# EAGLE design Un_51_2 (EAGLE 6.2)
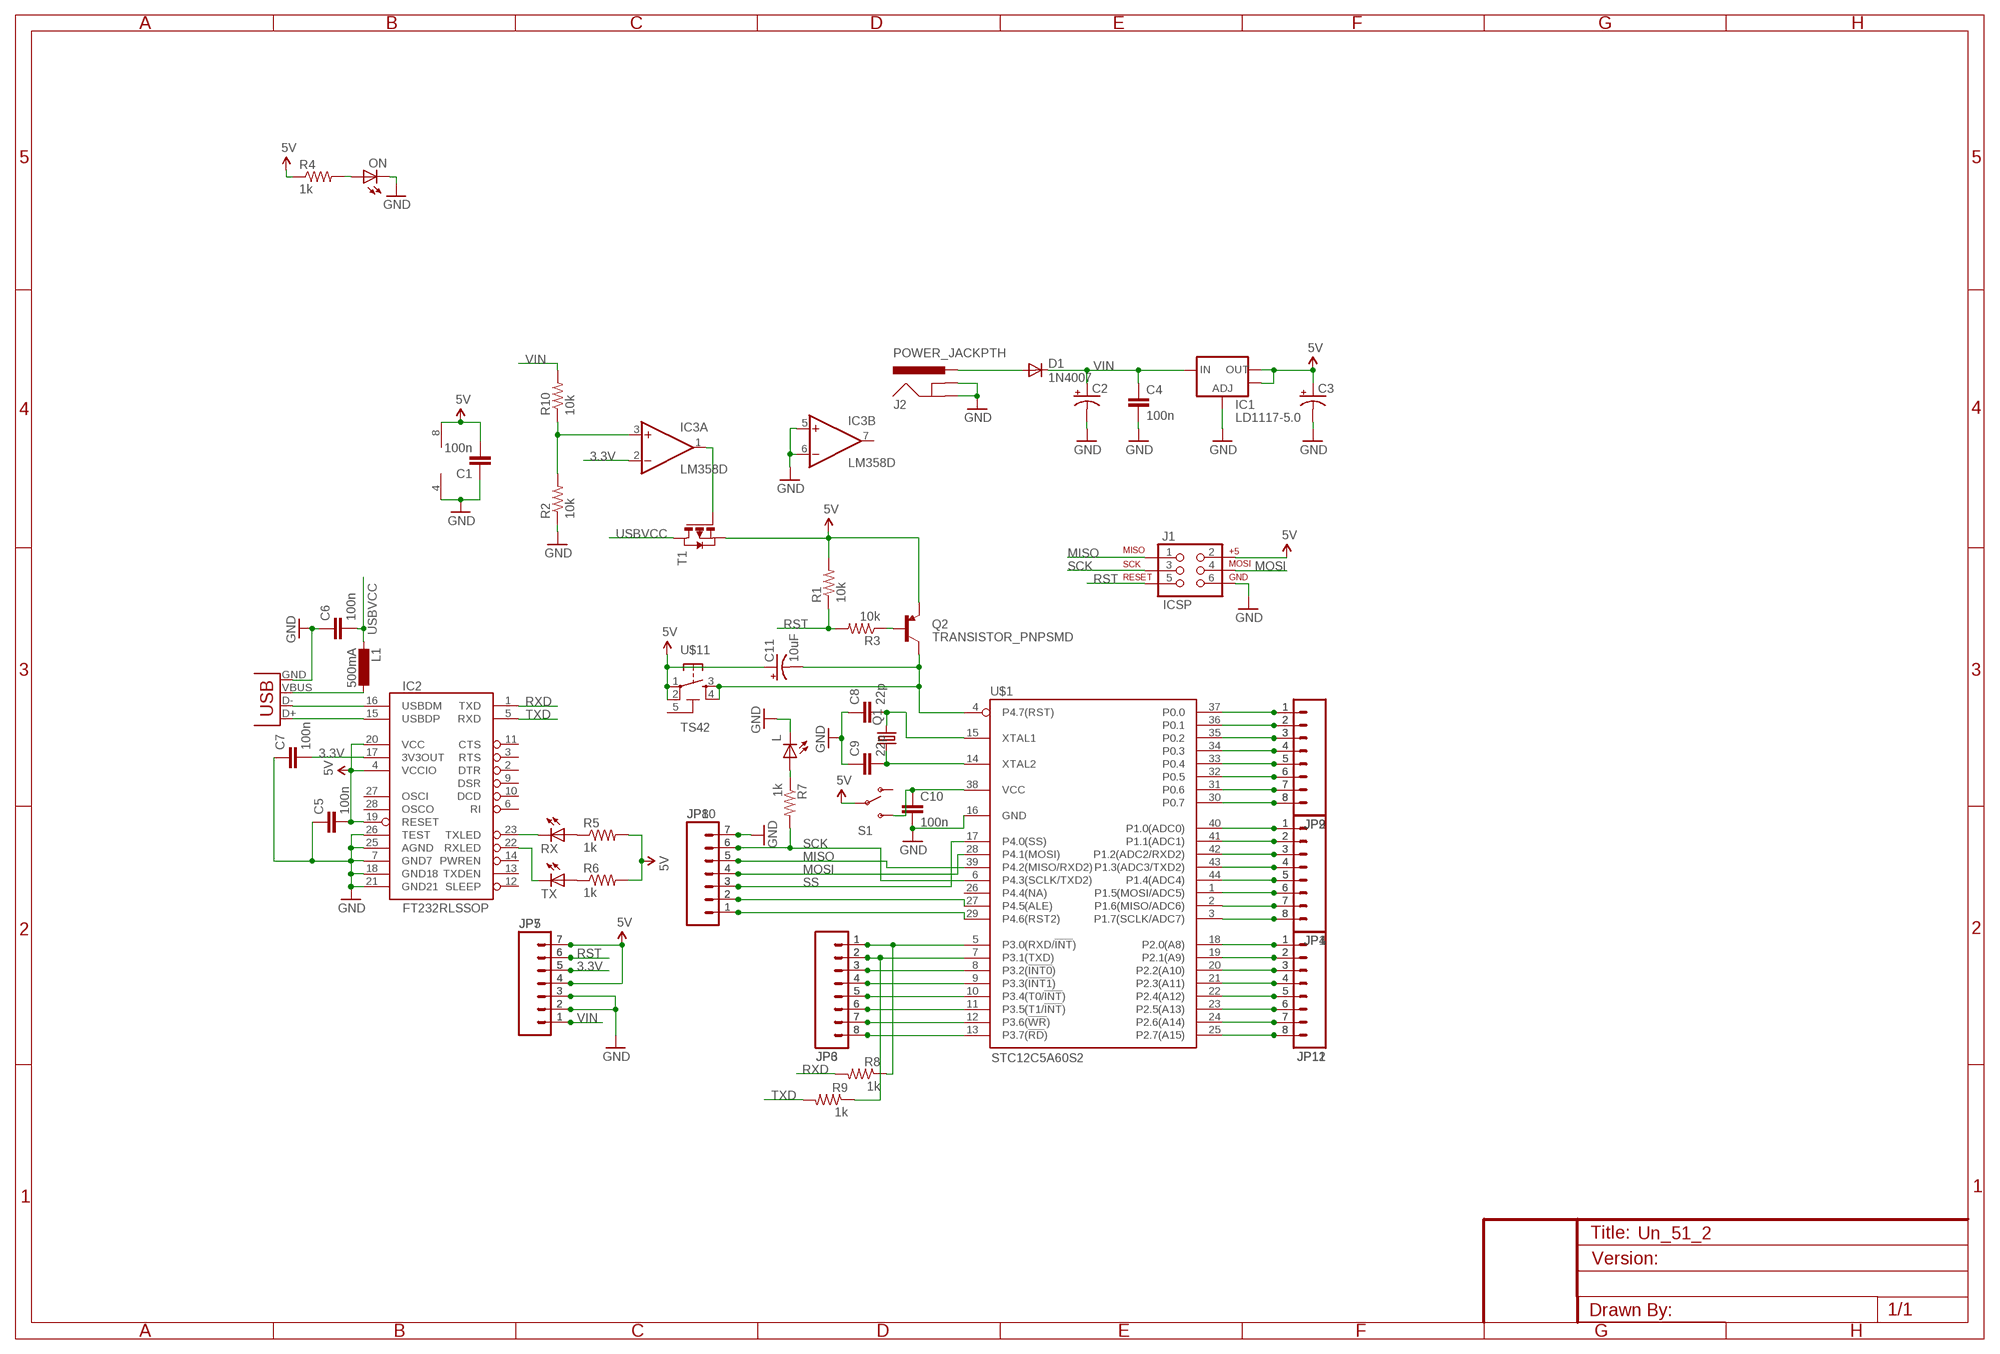
[diagram p0: schematic, sheet 1]

## Parts
C1  100n  CAP0603-CAP  [0603-CAP]
C2  CAP_POLD  [PANASONIC_D]
C3  CAP_POLD  [PANASONIC_D]
C4  100n  CAP0603-CAP  [0603-CAP]
C5  100n  CAP0603-CAP  [0603-CAP]
C6  100n  CAP0603-CAP  [0603-CAP]
C7  100n  CAP0603-CAP  [0603-CAP]
C8  22p  CAP0805  [0805]
C9  22p  CAP0805  [0805]
C10  100n  CAP0603-CAP  [0603-CAP]
C11  10uF  CAP_POL1206  [EIA3216]
D1  1N4007  DIODE-SMB  [SMB]
IC1  LD1117-5.0  V_REG_LM1117SOT223  [SOT223]
IC2  FT232RLSSOP  [SSOP28DB]
IC3  LM358D  [SO08]
J1  ICSP  AVR_SPI_PRG_6PTH  [2X3]
J2  POWER_JACKPTH  [POWER_JACK_PTH]
JP1  M081X08  [1X08]
JP2  M081X08  [1X08]
JP3  M08  [1X08]
JP4  M081X08  [1X08]
JP5  M07  [1X07]
JP6  M08  [1X08]
JP7  M07  [1X07]
JP8  M07  [1X07]
JP9  M081X08  [1X08]
JP10  M07  [1X07]
JP11  M081X08  [1X08]
JP12  M081X08  [1X08]
L  LED0805  [LED-0805]
L1  500mA  L-EUL1812  [L1812]
ON  LED0805  [LED-0805]
Q1  CRYSTALHC49US  [HC49US]
Q2  TRANSISTOR_PNPSMD  [SOT23-3]
R1  10k  RESISTOR0805-RES  [0805]
R2  10k  RESISTOR0805-RES  [0805]
R3  10k  RESISTOR0805-RES  [0805]
R4  1k  RESISTOR0805-RES  [0805]
R5  1k  RESISTOR0805-RES  [0805]
R6  1k  RESISTOR0805-RES  [0805]
R7  1k  RESISTOR0805-RES  [0805]
R8  1k  RESISTOR0805-RES  [0805]
R9  1k  RESISTOR0805-RES  [0805]
R10  10k  RESISTOR0805-RES  [0805]
RX  LED0805  [LED-0805]
S1  SWITCH-SPST  [SWITCH-SPDT2]
T1  PMOSSOT23  [SOT-23]
TX  LED0805  [LED-0805]
U$1  STC12C5A60S2  [TQFP44]
U$11  TS42  [TS42]
X1  USBPTH  [USB-B-PTH]

## Nets
3.3V: C7.2 IC2.17(3V3OUT) IC3.2(A:-IN) JP5.5 JP7.5
5V: C1.2 C3.+ C5.2 C11.A(+) IC1.2(OUT) IC1.4(OUT) IC2.4(VCCIO) IC2.19(RESET) IC2.20(VCC) IC3.8(P:V+) J1.2 JP5.4 JP5.7 JP7.4 JP7.7 Q2.2(E) R1.2 R4.1 R5.2 R6.2 S1.2(P) T1.2(S) U$11.1 U$11.2
A0: JP1.1 JP4.1 U$1.40(P1.0(ADC0))
GND [gnd]: C1.1 C2.- C3.- C4.2 C5.1 C6.1 C7.1 C8.1 C9.1 C10.2 IC1.1(ADJ) IC2.7(GND7) IC2.18(GND18) IC2.21(GND21) IC2.25(AGND) IC2.26(TEST) IC3.4(P:V-) IC3.5(B:+IN) IC3.6(B:-IN) J1.6 J2.GND J2.GNDBREAK JP5.2 JP5.3 JP7.2 JP7.3 JP8.7 JP10.7 L.2(C) ON.2(C) R2.1 U$1.16(GND) X1.GND
MISO: J1.1 JP8.5 JP10.5 U$1.39(P4.2(MISO/RXD2))
MOSI: J1.4 JP8.4 JP10.4 U$1.28(P4.1(MOSI))
N$1: IC3.3(A:+IN) R2.2 R10.1
N$2: IC3.1(A:OUT) T1.3(G)
N$3: L1.1 X1.VBUS
N$4: D1.A J2.PWR
N$5: IC2.16(USBDM) X1.D-
N$6: IC2.15(USBDP) X1.D+
N$7: R5.1 RX.1(A)
N$8: R6.1 TX.1(A)
N$9: IC2.23(TXLED) RX.2(C)
N$10: IC2.22(RXLED) TX.2(C)
N$11: JP3.1 JP6.1 R8.1 U$1.5(P3.0(RXD/!INT!))
N$12: JP1.7 JP4.7 U$1.2(P1.6(MISO/ADC6))
N$13: JP1.8 JP4.8 U$1.3(P1.7(SCLK/ADC7))
N$14: L.1(A) R7.1
N$15: C10.1 S1.3(S) U$1.38(VCC)
N$16: JP8.1 JP10.1 U$1.29(P4.6(RST2))
N$17: JP8.2 JP10.2 U$1.27(P4.5(ALE))
N$18: C11.C(-) Q2.3(C) U$1.4(P4.7(RST)) U$11.3 U$11.4
N$19: Q2.1(B) R3.1
N$20: JP2.1 JP9.1 U$1.37(P0.0)
N$22: JP2.2 JP9.2 U$1.36(P0.1)
N$23: JP3.2 JP6.2 R9.1 U$1.7(P3.1(TXD))
N$24: JP3.3 JP6.3 U$1.8(P3.2(!INT0!))
N$25: JP3.4 JP6.4 U$1.9(P3.3(!INT1!))
N$26: JP3.5 JP6.5 U$1.10(P3.4(T0/!INT!))
N$27: JP3.6 JP6.6 U$1.11(P3.5(T1/!INT!))
N$28: JP3.7 JP6.7 U$1.12(P3.6(!WR!))
N$30: JP3.8 JP6.8 U$1.13(P3.7(!RD!))
N$31: JP1.2 JP4.2 U$1.41(P1.1(ADC1))
N$32: JP1.3 JP4.3 U$1.42(P1.2(ADC2/RXD2))
N$33: JP1.4 JP4.4 U$1.43(P1.3(ADC3/TXD2))
N$34: ON.1(A) R4.2
N$35: JP2.3 JP9.3 U$1.35(P0.2)
N$36: JP2.4 JP9.4 U$1.34(P0.3)
N$37: JP2.5 JP9.5 U$1.33(P0.4)
N$39: C8.2 Q1.2 U$1.15(XTAL1)
N$40: C9.2 Q1.1 U$1.14(XTAL2)
N$41: JP2.6 JP9.6 U$1.32(P0.5)
N$42: JP2.7 JP9.7 U$1.31(P0.6)
N$43: JP2.8 JP9.8 U$1.30(P0.7)
N$44: JP11.1 JP12.1 U$1.18(P2.0(A8))
N$45: JP11.2 JP12.2 U$1.19(P2.1(A9))
N$46: JP11.3 JP12.3 U$1.20(P2.2(A10))
N$47: JP11.4 JP12.4 U$1.21(P2.3(A11))
N$48: JP11.5 JP12.5 U$1.22(P2.4(A12))
N$49: JP11.6 JP12.6 U$1.23(P2.5(A13))
N$50: JP11.7 JP12.7 U$1.24(P2.6(A14))
N$51: JP11.8 JP12.8 U$1.25(P2.7(A15))
RST: J1.5 JP5.6 JP7.6 R1.1 R3.2
RXD: IC2.1(TXD) R8.2
SCK: J1.3 JP8.6 JP10.6 R7.2 U$1.6(P4.3(SCLK/TXD2))
SCL: JP1.6 JP4.6 U$1.1(P1.5(MOSI/ADC5))
SDA: JP1.5 JP4.5 U$1.44(P1.4(ADC4))
SS: JP8.3 JP10.3 U$1.17(P4.0(SS))
TXD: IC2.5(RXD) R9.2
USBVCC: C6.2 L1.2 T1.1(D)
VIN: C2.+ C4.1 D1.C IC1.3(IN) JP5.1 JP7.1 R10.2
Unconnected: IC2.2(DTR) IC2.3(RTS) IC2.6(RI) IC2.9(DSR) IC2.10(DCD) IC2.11(CTS) IC2.12(SLEEP) IC2.13(TXDEN) IC2.14(PWREN) IC2.27(OSCI) IC2.28(OSCO) IC3.7(B:OUT) S1.1(O) U$1.26(P4.4(NA)) U$11.5

## Library data of the parts
C1 C4-C10 = 1SparkFun:CAP: Capacitor Standard 0603 ceramic capacitor, and 0.1" leaded capacitor.
C2 C3 C11 = 2SparkFun:CAP_POL: Capacitor Polarized These are standard SMD and PTH capacitors. Normally 10uF, 47uF, and 100uF in electrolytic and tantalum varieties. Always verify the external diameter of the through hole cap, it varies with capacity, voltage, and manufacturer. The EIA devices should be standard.
D1 = diode:DIODE-: DIODE
IC1 = 1SparkFun:V_REG_LM1117: Voltage Regulator LM1117 Standard adjustable voltage regulator but in SMD form. Spark Fun Electronics SKU : COM-00595
IC2 = 1SparkFun:FT232RL: USB UART FT232RL 4th Generation USB UART (USB <-> Serial) Controller. Spark Fun Electronics SKU : COM-00650
IC3 = linear:LM358: OP AMP also LM158; LM258; LM2904 Source: http://cache.national.com/ds/LM/LM158.pdf
J1 = 1SparkFun:AVR_SPI_PRG_6: AVR ISP 6 Pin This is the reduced ISP connector for AVR programming. Common on Arduino. This footprint will take up less PCB space and can be used with a 10-pin to 6-pin adapter such as SKU: BOB-08508
J2 = 2SparkFun:POWER_JACK: Power Jack This is the standard 5.5mm barrel jack for power. The PTH is the most common, proven, reliable, footprint. All others are experimental. The Slot footprint only works if the mill layer is transmitted to the PCB fab house so be warned. Spark Fun Electronics SKU : PRT-00119. Mating wall wart : TOL-00298 (and others)
JP1 JP2 JP4 JP9 JP11 JP12 = 2SparkFun:M08: Header 8 Standard 8-pin 0.1" header. Use with straight break away headers (SKU : PRT-00116), right angle break away headers (PRT-00553), swiss pins (PRT-00743), machine pins (PRT-00117), and female headers (PRT-00115).
JP3 JP6 = 1SparkFun:M08: Header 8 Standard 8-pin 0.1" header. Use with straight break away headers (SKU : PRT-00116), right angle break away headers (PRT-00553), swiss pins (PRT-00743), machine pins (PRT-00117), and female headers (PRT-00115).
JP5 JP7 JP8 JP10 = 2SparkFun:M07: Header 7 Standard 7-pin 0.1" header. Use with straight break away headers (SKU : PRT-00116), right angle break away headers (PRT-00553), swiss pins (PRT-00743), machine pins (PRT-00117), and female headers (PRT-00115). NOTES ON THE VARIANTS LOCK and LOCK_LONGPADS... This footprint was designed to help hold the alignment of a through-hole component (i.e. 7-pin header) while soldering it into place. You may notice that each hole has been shifted either up or down by 0.005 of an inch from it's more standard position (which is usually a perfectly straight line). This slight alteration caused the pins (the squares in the middle) to touch the edges of the holes. Because they are alternating, it causes a "brace" to hold the header in place. 0.005 has proven to be the perfect amount of "off-center" position when using our standard breakaway headers. Although looks a little odd when you look at the bare footprint, once you have a header in there, the alteration is very hard to notice. Also, if you push a header all the way into place, it is covered up entirely on the bottom side. This idea of altering the position of holes to aid alignment will be further integrated into the Sparkfun Library for other footprints. It can help hold any component with 3 or more connection pins.
L ON RX TX = 1SparkFun:LED: LEDs Standard schematic elements and footprints for 5mm, 3mm, 1206, and 0603 sized LEDs. 5mm - Spark Fun Electronics SKU : COM-00529 (and others)
L1 = rcl:L-EU: INDUCTOR, European symbol
Q1 = 1SparkFun:CRYSTAL: Crystals Various standard crystals. Proven footprints. Spark Fun Electronics SKU : COM-00534
Q2 = 1SparkFun:TRANSISTOR_PNP
R1-R10 = 2SparkFun:RESISTOR: Resistor Basic schematic elements and footprints for 0603, 1206, and PTH resistors.
S1 = 2SparkFun:SWITCH-SPST: SPST Switch Simple slide switch. Spark Fun Electronics SKU : COM-00102
T1 = zetex:PMOSSOT23: MOS FET; OC_FARNELL: unknown; OC_NEWARK: unknown
U$1 = 2SparkFun:STC12C5A60S2
U$11 = 2SparkFun:TS42
X1 = 1SparkFun:USB: USB Connectors USB-B-PTH is fully proven SKU : PRT-00139 USB-miniB is fully proven SKU : PRT-00587 USB-A-PCB is untested. USB-A-H is throughly reviewed, but untested. Spark Fun Electronics SKU : PRT-00437 USB-B-SMT is throughly reviewed, but untested. Needs silkscreen touching up. USB-A-S has not been used/tested USB-MB-H has not been used/tested

## Net classes
0 default: width 0.254 mm, clearance 0.254 mm
1 power: width 0.61 mm, drill 0.61 mm, clearance 0.254 mm
2 gnd: width 0.305 mm, drill 0.559 mm, clearance 0.254 mm
3 usbvcc: width 0.508 mm, drill 0.61 mm, clearance 0.254 mm
4 aref: width 0.406 mm, drill 0.61 mm, clearance 0.254 mm

## Board
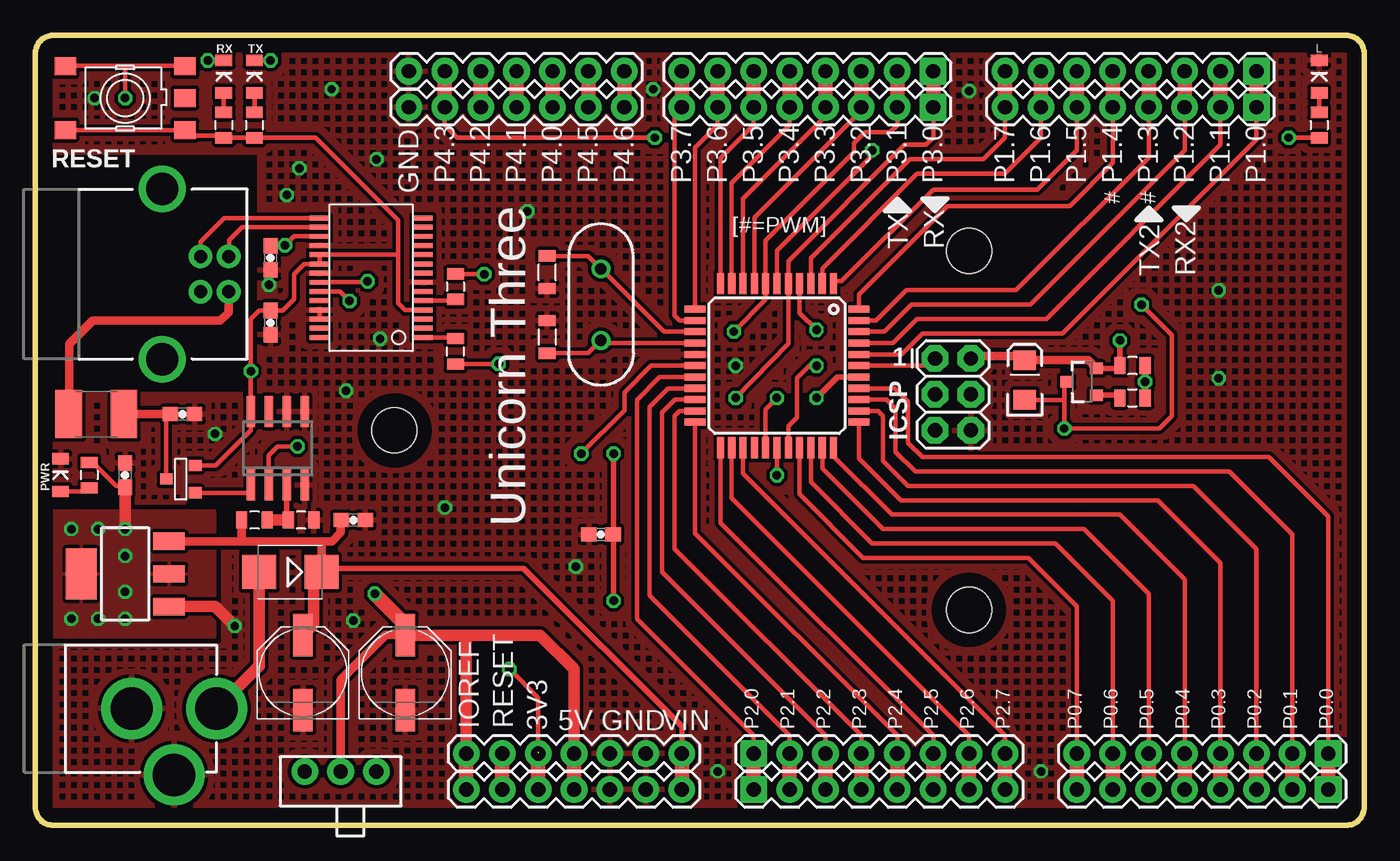
[diagram p1: board, top side]
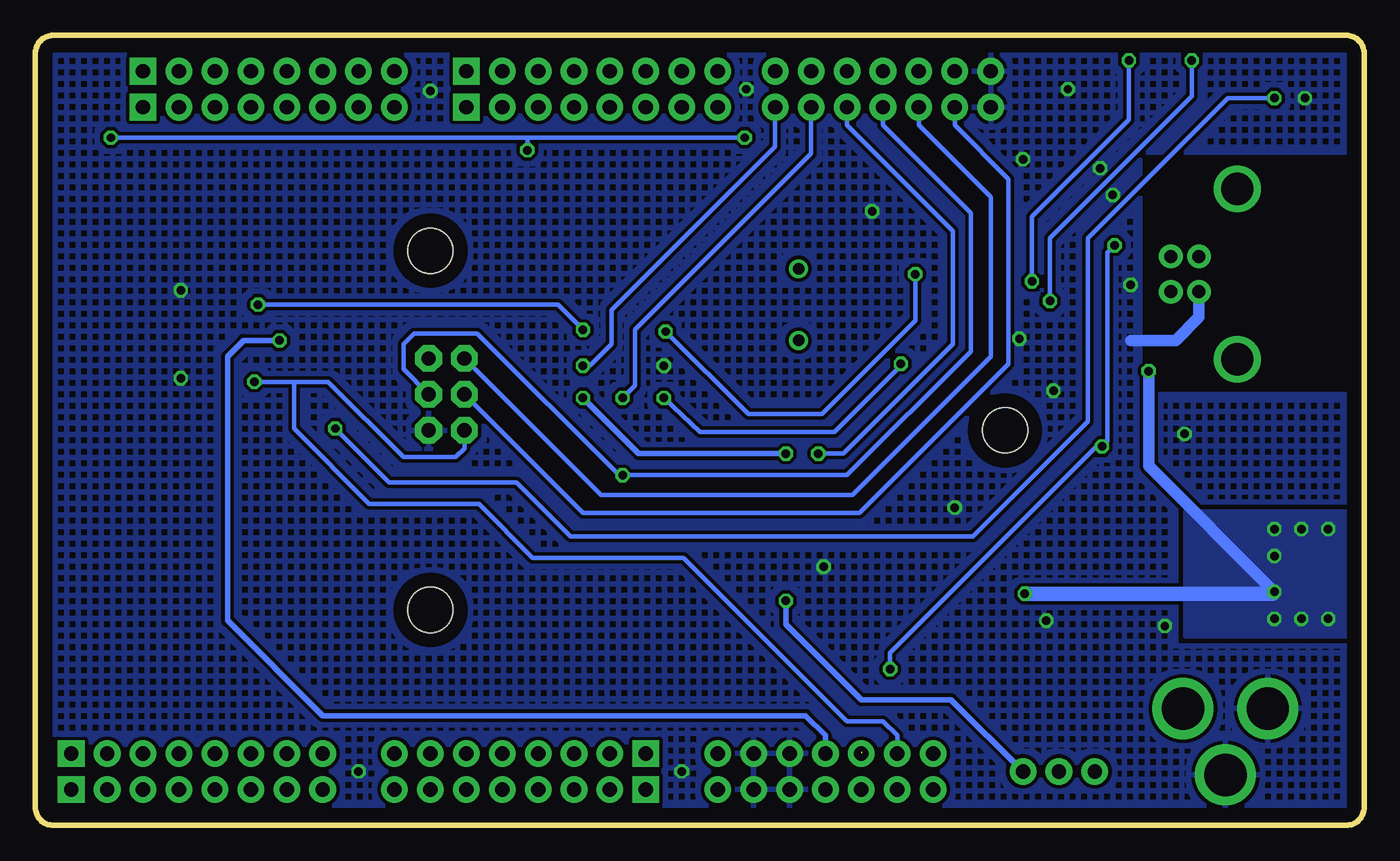
[diagram p2: board, bottom side, seen from below]

Size 93.98 x 55.88 mm. Coordinates in mm from the lower left corner, seen from the top.
Outline: 1.27,0 92.71,0 arc90 93.98,1.27 93.98,54.61 arc90 92.71,55.88 1.27,55.88 arc90 0,54.61 0,1.27 arc90 1.27,0
Copper layers (1*16): Top 0.035mm / dielectric 1.5mm / Bottom 0.035mm
Design rules "default": minimum track width 10mil, minimum drill 24mil, track to track 8mil, track to pad 8mil, pad to pad 8mil, via to via 8mil, smd to smd 8mil, copper to edge 40mil, drill to drill 8mil, minimum pad ring 10mil, minimum via ring 8mil, stop-mask expansion 4mil, vias tented up to drill 0mil, thermal gap 10mil
Holes 3.2 mm at 66.04,40.64 66.04,15.24 25.4,27.94

### Footprints (pad centres in the part's own frame; a part is rotated, then mirrored left to right if it is on the bottom)
0603-CAP = smd 1.1 x 1: 1 -0.85,0; 2 0.85,0
PANASONIC_D = smd 3 x 1.4: + 2.654,0; - -2.654,0
0805 = smd 0.8 x 1.2: 1 -1.154,0; 2 1.154,0
EIA3216 = smd 1.4 x 1.6: A 1.4,0; C -1.4,0
SMB = smd 2.4 x 2.4: A 2.2,0; C -2.2,0
SOT223 = smd 1.219 x 2.235: 1 -2.311,-3.099; 2 0,-3.099; 3 2.311,-3.099 | smd 3.6 x 2.2: 4 0,3.099
SSOP28DB = smd 0.348 x 1.397: 1 -4.225,-3.656; 2 -3.575,-3.656; 3 -2.925,-3.656; 4 -2.275,-3.656; 5 -1.625,-3.656; 6 -0.975,-3.656; 7 -0.325,-3.656; 8 0.325,-3.656; 9 0.975,-3.656; 10 1.625,-3.656; 11 2.275,-3.656; 12 2.925,-3.656; 13 3.575,-3.656; 14 4.225,-3.656; 15 4.225,3.656; 16 3.575,3.656; 17 2.925,3.656; 18 2.275,3.656; 19 1.625,3.656; 20 0.975,3.656; 21 0.325,3.656; 22 -0.325,3.656; 23 -0.975,3.656; 24 -1.625,3.656; 25 -2.275,3.656; 26 -2.925,3.656; 27 -3.575,3.656; 28 -4.225,3.656
SO08 = smd 0.6 x 2.2: 1 -1.905,-2.6; 2 -0.635,-2.6; 3 0.635,-2.6; 4 1.905,-2.6; 5 1.905,2.6; 6 0.635,2.6; 7 -0.635,2.6; 8 -1.905,2.6
2X3 = drill 1.016 pad 1.88 octagon: 1 0,0; 2 0,2.54; 3 2.54,0; 4 2.54,2.54; 5 5.08,0; 6 5.08,2.54
POWER_JACK_PTH = drill 2.997 pad 4.318: GND 0,7.7; GNDBREAK 4.7,10.7; PWR 0,13.7
1X08 = drill 1.016 pad 1.88 square: 1 0,0 | drill 1.016 pad 1.88: 2 2.54,0; 3 5.08,0; 4 7.62,0; 5 10.16,0; 6 12.7,0; 7 15.24,0; 8 17.78,0
1X07 = drill 1.016 pad 1.88: 1 0,0; 2 2.54,0; 3 5.08,0; 4 7.62,0; 5 10.16,0; 6 12.7,0; 7 15.24,0
LED-0805 = smd 0.8 x 1.2: 1 -1.154,0; 2 1.154,0
L1812 = smd 1.9 x 3.4: 1 -1.95,0; 2 1.95,0
HC49US = drill 0.813: 1 -2.54,0; 2 2.54,0
SOT23-3 = smd 0.8 x 0.9: 1 -0.95,-1; 2 0.95,-1; 3 0,1.1
0805' = smd 0.8 x 1.2: 1 -0.9,0; 2 0.9,0
SWITCH-SPDT2 = drill 1.016 pad 1.88: 1 0,2.54; 2 0,0; 3 0,-2.54
SOT-23 = smd 0.787 x 0.889: 1 0.025,-1.016; 2 -0.94,1.016; 3 0.991,1.016
TQFP44 = smd 1.5 x 0.5: 1 -5.8,4; 2 -5.8,3.2; 3 -5.8,2.4; 4 -5.8,1.6; 5 -5.8,0.8; 6 -5.8,0; 7 -5.8,-0.8; 8 -5.8,-1.6; 9 -5.8,-2.4; 10 -5.8,-3.2; 11 -5.8,-4; 23 5.8,-4; 24 5.8,-3.2; 25 5.8,-2.4; 26 5.8,-1.6; 27 5.8,-0.8; 28 5.8,0; 29 5.8,0.8; 30 5.8,1.6; 31 5.8,2.4; 32 5.8,3.2; 33 5.8,4 | smd 0.5 x 1.5: 12 -4,-5.8; 13 -3.2,-5.8; 14 -2.4,-5.8; 15 -1.6,-5.8; 16 -0.8,-5.8; 17 0,-5.8; 18 0.8,-5.8; 19 1.6,-5.8; 20 2.4,-5.8; 21 3.2,-5.8; 22 4,-5.8; 34 4,5.8; 35 3.2,5.8; 36 2.4,5.8; 37 1.6,5.8; 38 0.8,5.8; 39 0,5.8; 40 -0.8,5.8; 41 -1.6,5.8; 42 -2.4,5.8; 43 -3.2,5.8; 44 -4,5.8
TS42 = smd 1.524 x 1.27: 1 -4.229,2.25; 2 4.229,2.25; 3 -4.229,-2.25; 4 4.229,-2.25; 5 -4.229,-0.002
USB-B-PTH = drill 0.914 pad 1.676: D+ 0,1.25; D- 1.981,1.25; GND 0,-1.25; VBUS 1.981,-1.25 | drill 2.286: P$1 -2.718,-6.02; P$2 -2.718,6.02

### Placement (x,y rotation side)
C1  6.35,24.77 270 top
C2  18.92,10.79 90 top
C3  26.16,10.79 90 top
C4  22.48,21.59 0 top
C5  16.64,35.56 90 top
C6  10.41,29.08 180 top
C7  16.64,40.13 90 top
C8  36.19,34.54 270 top
C9  36.19,39.12 90 top
C10  40,20.57 180 top
C11  69.98,31.5 90 top
D1  18.03,17.91 180 top
IC1  6.35,17.78 90 top
IC2  23.75,38.73 90 top
IC3  17.14,26.67 0 top
J1  63.63,33.02 270 top
J2  -0.89,8.26 270 top
JP1  86.36,53.34 180 top
JP2  91.44,5.08 180 top
JP3  63.5,53.34 180 top
JP4  86.36,50.8 180 top
JP5  45.72,2.54 180 top
JP6  63.5,50.8 180 top
JP7  45.72,5.08 180 top
JP8  41.66,50.8 180 top
JP9  91.44,2.54 180 top
JP10  41.66,53.34 180 top
JP11  50.8,5.08 0 top
JP12  50.8,2.54 0 top
L  90.81,52.96 90 top
L1  4.32,29.08 0 top
ON  1.78,24.77 90 top
Q1  40,36.83 270 top
Q2  74.04,31.37 90 top
R1  10k  [0805']  77.6,32.51 180 top
R2  10k  [0805']  18.8,21.59 180 top
R3  10k  [0805']  77.6,30.23 0 top
R4  1k  [0805']  3.81,24.77 270 top
R5  1k  [0805']  13.33,49.53 270 top
R6  1k  [0805']  15.49,49.53 270 top
R7  1k  [0805']  90.81,49.53 270 top
R8  1k  [0805']  29.72,33.53 90 top
R9  1k  [0805']  29.72,38.1 270 top
R10  10k  [0805']  15.49,21.59 180 top
RX  13.33,52.96 90 top
S1  21.59,3.81 90 top
T1  10.29,24.51 270 top
TX  15.49,52.96 90 top
U$1  52.45,32.51 270 top
U$11  6.35,51.44 180 top
X1  11.68,38.99 0 top

### Tracks (layer width: path | path; a pad name or v marks a point on that pad's centre or on a via)
3.3V  (via drill 0.6)  (1 unrouted)
  Top 0.305: 16.68,40.77 C7.2 16.68,41.02 v17.65,41.02 18.29,41.66 IC2.17 | 35.69,5.08 35.56,5.21 35.56,9.02 v33.53,11.05 | IC3.2 16.51,26.16 17.14,26.8 v18.54,26.8
  Top 1.016: JP7.5 JP5.5
  Bottom 0.305: v33.53,11.05 33.53,12.19 18.92,26.8 v18.54,26.8 18.16,27.18 18.16,40.51 v17.65,41.02
5V  (via drill 0.6)
  Top 0.305: R4.1 4.05,25.66 5.72,24 6.26,24 C1.2 | T1.2 12.75,25.45 15.24,27.94 IC3.8 v15.24,32.13 | 20.09,39.78 IC2.19 25.5,40.36 arc90 25.65,40.51 | 20.09,39.78 20.07,39.75 | 25.65,40.51 25.65,42.8 19.82,48.63 R6.2 15.37,48.76 15.37,48.77 15.23,48.63 R5.2 13.2,48.77 11,48.77 U$11.1 U$11.2 | IC2.4 27.39,36.45 26.16,36.45 25.65,36.96 25.65,40.51 | v15.24,32.13 15.24,35.81 15.84,36.41 C5.2 17.49,36.41 18.29,37.21 18.29,38.99 19.01,39.71 IC2.20 20.09,39.78 | v15.24,32.13 15.24,31.5
  Top 0.406: Q2.2 76.5,32.32 R1.2 76.71,32.52 v76.71,34.29
  Top 0.61: S1.2 21.59,10.29 24.77,13.46 26.15,13.46 C3.+ | J1.2 66.36,33.21 69.85,33.21 69.98,33.08 C11.A 74.46,32.9 Q2.2
  Top 0.813: C1.2 v6.35,20.95 | 26.16,12.83 C3.+ 30.48,13.45 | JP7.4 38.1,11.05 35.7,13.45 30.48,13.45 | JP7.7 30.48,13.45
  Top 1.016: JP7.4 JP5.4 | JP5.7 JP7.7 | C3.+ 26.16,14.22 v24,16.38
  Bottom 0.406: JP7.4 38.1,6.35 39.5,7.75 73.66,7.75 80.39,14.48 80.39,33.15 79.25,34.29 v76.71,34.29
  Bottom 0.813: v6.35,16.51 15.24,25.4 v15.24,32.13
  Bottom 1.016: v24,16.38 6.48,16.38 v6.35,16.51
  other vias: 4.44,20.95 6.35,19.05 6.35,14.61 4.44,14.61 2.54,14.61 2.54,20.95
  pour Bottom: 1.27,22.23 12.7,22.23 12.7,13.34 1.27,13.34
  pour Top: 1.27,13.34 12.7,13.34 12.7,22.23 1.27,22.23
A0
  Top 0.305: U$1.40 61.25,33.31 62.74,34.8 72.64,34.8 86.36,48.51 JP4.1
  Top 1.016: JP1.1 JP4.1
GND  (via drill 0.6)
  Top 0.305: IC2.25 IC2.26 | v16.51,38.23 16.51,39.12 16.64,39.24
  Top 0.813: IC1.1 12.72,15.47 v14.1,14.1
  Bottom 0.813: X1.GND 11.68,35.94 13.33,34.29 16.51,34.29
  other vias: 17.78,44.58 22.48,14.48 34.8,43.43 48.26,3.81 21.97,30.73 28.96,22.48 24.38,34.42 20.95,52.07 83.69,31.62 24.13,47.12 38.23,18.29 83.69,37.85 66.04,51.94 43.69,52.07 71.12,3.81 49.53,32.51 12.7,27.69 4.19,51.44 18.67,46.48
  pour Top (hatched): 0,55.88 93.98,55.88 93.98,0 0,0 0,12.7 13.33,12.7 13.33,22.86 0,22.86 0,30.48 15.88,30.48 15.88,47.62 0,47.62
  pour Bottom (hatched): 0,55.88 93.98,55.88 93.98,0 0,0 0,12.7 13.33,12.7 13.33,22.86 0,22.86 0,30.48 15.88,30.48 15.88,47.62 0,47.62
MISO
  Top 0.305: U$1.39 63.12,32.51 J1.1
  Top 1.016: JP10.5 JP8.5
  Bottom 0.305: JP8.5 31.5,49.53 26.42,44.45 26.42,33.15 36.19,23.37 53.97,23.37 J1.1
MOSI  (via drill 0.6)
  Top 0.305: v52.45,24.77 U$1.28
  Top 1.016: JP10.4 JP8.4
  Bottom 0.305: JP8.4 34.04,49.53 27.81,43.31 27.81,33.53 36.58,24.77 v52.45,24.77 52.7,24.77 62.74,34.8 67.18,34.8 67.94,34.04 67.94,32.26 J1.4
N$1
  Top 0.406: IC3.3 17.78,21.71 R2.2
  Top 0.813: R10.1 R2.2
N$2
  Top 0.305: T1.3 15.34,23.52 15.37,23.5 15.37,23.94 IC3.1
N$3
  Top 0.61: X1.VBUS 13.67,36.27 13.08,35.69 4.06,35.69 2.41,34.04 2.41,29.13 L1.1
N$4
  Top 0.813: D1.A 15.83,11.25 15.81,11.25 J2.PWR
N$5
  Top 0.305: IC2.16 14.62,42.31 13.72,41.4 13.72,40.29 X1.D-
N$6
  Top 0.305: IC2.15 13.37,42.96 11.68,41.27 X1.D+
N$7
  Top 0.305: RX.1 R5.1
N$8
  Top 0.305: R6.1 TX.1
N$9  (via drill 0.6)
  Top 0.305: RX.2 12.2,54.11 v12.19,54.1 | IC2.23 21.55,37.76 v22.22,37.08
  Bottom 0.305: v12.19,54.1 12.19,51.56 22.22,41.53 v22.22,37.08
N$10  (via drill 0.6)
  Top 0.305: TX.2 16.5,54.11 v16.64,54.1 | IC2.22 23.42,38.41 v23.5,38.48
  Bottom 0.305: v16.64,54.1 16.64,49.91 23.5,43.05 v23.5,38.48
N$11  (via drill 0.6)
  Top 0.305: JP6.1 63.5,48.64 62.99,48.13 61.47,48.13 53.25,39.92 U$1.5 53.25,34.07 v49.53,30.23 | v32.77,32.64 32.75,32.63 R8.1
  Top 1.016: JP3.1 JP6.1
  Bottom 0.305: v32.77,32.64 32.77,32.51 37.47,27.81 46.99,27.81 v49.53,30.23
N$12
  Top 0.305: U$1.2 55.65,39.4 62.36,46.1 68.58,46.1 71.12,48.64 JP4.7
  Top 1.016: JP1.7 JP4.7
N$13
  Top 0.305: U$1.3 54.85,40.12 61.85,47.12 67.06,47.12 68.58,48.64 JP4.8
  Top 1.016: JP1.8 JP4.8
N$14
  Top 0.305: L.1 R7.1
N$15  (via drill 0.6)
  Top 0.305: 40.89,20.54 C10.1 40.89,20.61
  Top 0.406: U$1.38 56.73,31.71 v55.25,30.23 | v40.89,15.88 40.89,20.54 | v40.89,26.29 40.89,20.61
  Bottom 0.406: v55.25,30.23 51.31,26.29 v40.89,26.29 | v40.89,15.88 40.89,14.22 35.56,8.89 29.21,8.89 S1.3
N$16  (via drill 0.6)
  Top 0.305: v55.25,32.51 54.74,32.51 53.85,31.62 53.85,28.83 53.25,28.23 U$1.29
  Top 1.016: JP10.1 JP8.1
  Bottom 0.305: JP8.1 41.66,48.01 53.21,36.45 53.21,34.04 54.74,32.51 v55.25,32.51
N$17  (via drill 0.6)
  Top 0.305: JP8.2 39.12,50.67 39.24,50.55 | U$1.27 51.65,29.43 v52.45,30.23
  Top 1.016: JP8.2 JP10.2
  Bottom 0.305: JP8.2 39.12,47.5 51.56,35.05 51.56,31.11 v52.45,30.23
N$18  (via drill 0.6)
  Top 0.305: U$1.4 54.05,36.25 v55.25,35.05 | 72.77,30.1 v72.77,28.07 79.5,28.07 80.39,28.96 80.39,34.67 v78.23,36.83 | 72.77,30.1 72.77,31.2 Q2.3 | C11.C 72.77,30.1 | v6.35,51.44 6.35,53.72 | 6.35,53.72 2.12,53.72 U$11.4 | U$11.3 10.58,53.72 6.35,53.72
  Bottom 0.305: v6.35,51.44 9.65,51.44 19.56,41.53 19.56,28.57 27.69,20.45 56.13,20.45 59.94,24.26 68.96,24.26 v72.77,28.07 | v55.25,35.05 57.02,36.83 v78.23,36.83
N$19
  Top 0.406: Q2.1 76.5,30.42 R3.1
N$20
  Top 0.305: U$1.37 60.78,30.91 61.72,29.97 61.72,27.05 62.74,26.04 87.25,26.04 91.44,21.84 JP2.1
  Top 1.016: JP2.1 JP9.1
N$22
  Top 0.305: U$1.36 60.19,30.11 60.83,29.46 60.83,26.42 62.23,25.02 84.46,25.02 88.9,20.57 JP2.2
  Top 1.016: JP9.2 JP2.2
N$23  (via drill 0.6)
  Top 0.305: JP6.2 60.96,49.53 60.45,49.02 58.67,49.02 57.91,48.26 57.91,47.62 51.65,41.36 U$1.7 51.65,37.17 v49.4,34.92 | v31.75,38.99 v31.74,39 R9.1
  Top 1.016: JP6.2 JP3.2
  Bottom 0.305: v31.75,38.99 31.75,35.69 38.35,29.08 43.56,29.08 v49.4,34.92
N$24
  Top 0.305: U$1.8 50.85,42.98 58.42,50.55 JP6.3
  Top 1.016: JP6.3 JP3.3
N$25
  Top 0.305: U$1.9 50.05,44.34 55.88,50.16 JP6.4
  Top 1.016: JP6.4 JP3.4
N$26
  Top 0.305: U$1.10 49.25,45.44 53.34,49.53 JP6.5
  Top 1.016: JP6.5 JP3.5
N$27
  Top 0.305: U$1.11 48.45,47.18 50.8,49.53 JP6.6
  Top 1.016: JP6.6 JP3.6
N$28
  Top 0.305: U$1.12 46.65,47.92 48.26,49.53 JP6.7
  Top 1.016: JP6.7 JP3.7
N$30
  Top 0.305: U$1.13 45.57,35.71 45.21,36.07 45.21,50.29 JP6.8
  Top 1.016: JP6.8 JP3.8
N$31
  Top 0.305: U$1.41 60.66,34.11 62.36,35.81 71.5,35.81 83.82,48.13 JP4.2
  Top 1.016: JP4.2 JP1.2
N$32
  Top 0.305: U$1.42 60.06,34.91 61.98,36.83 70.36,36.83 81.28,47.75 JP4.3
  Top 1.016: JP1.3 JP4.3
N$33
  Top 0.305: U$1.43 59.46,35.71 61.59,37.85 69.34,37.85 78.74,47.24 JP4.4
  Top 1.016: JP4.4 JP1.4
N$34
  Top 0.305: ON.1 3.56,23.61 R4.2
N$35
  Top 0.305: U$1.35 59.59,29.31 59.94,28.96 59.94,26.04 59.94,25.91 59.94,25.78 61.72,24 81.91,24 86.36,19.56 JP2.3
  Top 1.016: JP9.3 JP2.3
N$36
  Top 0.305: U$1.34 58.25,25.95 61.21,22.99 79.38,22.99 83.82,18.54 JP2.4
  Top 1.016: JP9.4 JP2.4
N$37
  Top 0.305: U$1.33 56.45,26.35 | JP2.5 81.28,17.4 76.71,21.97 60.58,21.97 56.45,26.1 U$1.33 | 56.45,26.23 U$1.33
  Top 1.016: JP9.5 JP2.5
N$39
  Top 0.305: U$1.15 40.18,34.11 Q1.2 39.11,33.39 C8.2
N$40
  Top 0.305: C9.2 39.11,40.27 Q1.1 44.46,34.91 U$1.14
N$41
  Top 0.305: U$1.32 55.65,25.25 59.94,20.95 74.17,20.95 78.74,16.38 78.74,4.57
  Top 1.016: JP9.6 78.74,4.57 JP2.6
N$42
  Top 0.305: U$1.31 54.85,24.27 59.18,19.94 72.14,19.94 76.2,15.88 JP2.7
  Top 1.016: JP9.7 JP2.7
N$43
  Top 0.305: U$1.30 54.05,23.42 58.55,18.92 70.23,18.92 73.66,15.49 JP2.8
  Top 1.016: JP9.8 JP2.8
N$44
  Top 0.305: U$1.18 44.16,31.71 42.55,30.1 42.55,14.61 50.8,6.35 JP11.1
  Top 1.016: JP12.1 JP11.1
N$45
  Top 0.305: U$1.19 44.75,30.91 43.43,29.59 43.43,16.26 53.34,6.35 JP11.2
  Top 1.016: JP12.2 JP11.2
N$46
  Top 0.305: U$1.20 45.22,30.11 44.32,29.21 44.32,17.91 55.88,6.35 JP11.3
  Top 1.016: JP12.3 JP11.3
N$47
  Top 0.305: U$1.21 45.57,29.31 45.21,28.96 45.21,19.56 58.42,6.35 JP11.4
  Top 1.016: JP12.4 JP11.4
N$48
  Top 0.305: U$1.22 46.65,24.38 46.65,24.09 46.65,20.66 60.96,6.35 JP11.5
  Top 1.016: JP12.5 JP11.5
N$49
  Top 0.305: U$1.23 48.45,21.4 63.5,6.35 JP11.6
  Top 1.016: JP12.6 JP11.6
N$50
  Top 0.305: U$1.24 49.25,23.14 66.04,6.35 JP11.7
  Top 1.016: JP12.7 JP11.7
N$51
  Top 0.305: U$1.25 50.05,24.88 68.58,6.35 68.58,5.59 JP11.8
  Top 1.016: JP12.8 68.58,5.59
RST  (via drill 0.6)
  Top 0.305: R1.1 v78.5,31.38 v78.49,31.37 78.5,31.36 R3.2
  Top 1.016: JP5.6 JP7.6
  Bottom 0.305: JP7.6 33.02,6.35 34.04,7.37 36.58,7.37 48.13,18.92 58.8,18.92 62.61,22.73 70.36,22.73 75.69,28.07 75.69,31.37 | J1.5 63.63,26.67 64.26,26.04 67.94,26.04 73.28,31.37 75.69,31.37 | 75.69,31.37 v78.49,31.37
RXD
  Top 0.305: IC2.1 29.62,34.51 29.72,34.42 R8.2
SCK  (via drill 0.6)
  Top 0.305: R7.2 v88.66,48.63 v88.65,48.64 | U$1.6 52.45,40.64 59.18,47.37 v59.18,47.75 | JP8.6 28.96,49.53 29.84,48.64 v43.81,48.64
  Top 1.016: JP10.6 JP8.6
  Bottom 0.305: 59.18,48.64 v88.65,48.64 | v59.18,47.75 59.18,48.64 | v43.81,48.64 59.18,48.64 | JP8.6 28.96,49.53 25.15,45.72 25.15,32.64 35.69,22.1 55.25,22.1 J1.3
SCL
  Top 0.305: JP4.6 73.66,47.75 70.87,44.96 63.5,44.96 57.02,38.48 56.62,38.48 U$1.1 56.45,38.42
  Top 1.016: JP1.6 JP4.6
SDA
  Top 0.305: U$1.44 58.25,37.55 64.52,43.81 73.15,43.81 76.2,46.86 JP4.5
  Top 1.016: JP1.5 JP4.5
SS  (via drill 0.6)
  Top 0.305: U$1.17 43.56,32.51 41.66,30.61 41.66,29.34 v38.61,26.29
  Top 1.016: JP10.3 JP8.3
  Bottom 0.305: JP8.3 36.58,49.53 29.08,42.04 29.08,34.04 36.83,26.29 v38.61,26.29
TXD
  Top 0.305: IC2.5 29.63,37.11 R9.2
USBVCC
  Top 0.305: T1.1 9.27,28.66 C6.2
  Top 0.61: C6.2 L1.2
VIN
  Top 0.406: 19.69,14.21 19.69,17.53 20.32,18.16 | JP7.1 45.72,6.99 34.54,18.16 20.49,18.16 D1.C
  Top 0.61: IC1.3 14.73,20.09 | R10.2 14.59,20.23 14.73,20.09 | 14.73,20.09 20.32,20.09 | 20.32,20.09 20.98,20.09 21.59,20.7 21.59,21.55 C4.1 | 20.32,20.09 20.23,20 D1.C 19.81,17.91 19.69,17.78
  Top 0.813: C2.+ 19.69,14.21 19.69,17.78
  Top 1.016: JP7.1 JP5.1

### Text on the board
tPlace: P4.2 | P4.1 | P4.0 | P4.5 | P4.6 | P3.7 | P3.6 | P3.5 | P3.4 | P3.3 | P3.2 | P3.1 | P3.0 | P1.7 | P1.6 | P1.5 | P1.4 | P1.3 | P1.2 | P1.1 | P1.0 | Unicorn Three
tNames: RX | TX | P4.3 | GND | RESET | # | # | [#=PWM] | TX | RX | TX2 | RX2 | 1 | ICSP | PWR | IOREF | RESET | 3V3 | 5V | GND | VIN | P2.0 | P2.1 | P2.2 | P2.3 | P2.4 | P2.5 | P2.6 | P2.7 | P0.7 | P0.6 | P0.5 | P0.4 | P0.3 | P0.2 | P0.1 | P0.0